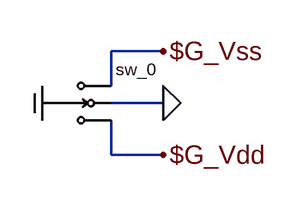
[diagram p0: schematic trit-0.asc]
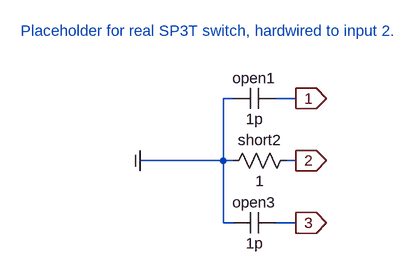
[diagram p1: sub-circuit sp3t-2.asc]
trit-0.asc, the LTspice schematic file:
Version 4
SHEET 1 880 680
WIRE 224 96 176 96
WIRE 176 128 176 96
WIRE 224 144 176 144
WIRE 176 192 176 160
WIRE 224 192 176 192
FLAG 112 144 COM
IOPIN 112 144 In
FLAG 224 96 $G_Vss
FLAG 224 144 0
FLAG 224 192 $G_Vdd
SYMBOL sp3t-2 176 144 R0
SYMATTR InstName sw_0

sp3t-2.asc, the sub-circuit schematic file:
Version 4
SHEET 1 880 680
WIRE 144 64 128 64
WIRE 240 64 208 64
WIRE 128 160 128 64
WIRE 128 160 0 160
WIRE 144 160 128 160
WIRE 240 160 224 160
WIRE 128 256 128 160
WIRE 144 256 128 256
WIRE 240 256 208 256
FLAG 0 160 COM
IOPIN 0 160 In
FLAG 240 64 1
IOPIN 240 64 Out
FLAG 240 160 2
IOPIN 240 160 Out
FLAG 240 256 3
IOPIN 240 256 Out
SYMBOL cap 208 48 R90
WINDOW 0 0 32 VBottom 0
WINDOW 3 32 32 VTop 0
SYMATTR InstName open1
SYMATTR Value 1p
SYMBOL cap 208 240 R90
WINDOW 0 0 32 VBottom 0
WINDOW 3 32 32 VTop 0
SYMATTR InstName open3
SYMATTR Value 1p
SYMBOL res 240 144 R90
WINDOW 0 0 56 VBottom 0
WINDOW 3 32 56 VTop 0
SYMATTR InstName short2
SYMATTR Value 1
TEXT -184 -40 Left 0 ;Placeholder for real SP3T switch, hardwired to input 2.

The netlist it stands for:
* trit-0.asc
Xsw_0 $G_Vss 0 COM $G_Vdd sp3t-2

* block symbol definitions
.subckt sp3t-2 1 2 COM 3
C§open1 1 COM 1p
C§open3 3 COM 1p
R§short2 2 COM 1
* Placeholder for real SP3T switch, hardwired to input 2.
.ends sp3t-2

.backanno
.end